# Altium project TestPCB.PrjPcb
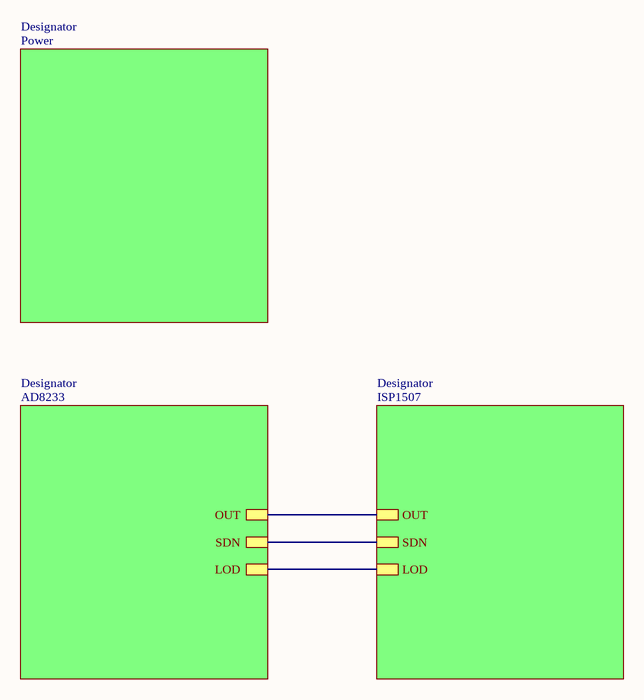
[diagram p0: main.SchDoc]
4 sheets, 45 parts. Net scope: hierarchical (ports join the sheet entries above them; power ports are global).
Board file: PCB1.PcbDoc
Sheets:
  main.SchDoc
    Designator = Power.SchDoc
    Designator = AD8233.SchDoc
    Designator = ISP1507.SchDoc

## Sheet main.SchDoc
size A3

### Sub-sheets
Designator = Power: no entries
Designator = AD8233: SDN, OUT, LOD
Designator = ISP1507: OUT, SDN, LOD

### Nets
LOD: sheet Designator/LOD, sheet Designator/LOD
OUT: sheet Designator/OUT, sheet Designator/OUT
SDN: sheet Designator/SDN, sheet Designator/SDN

## Sheet Power.SchDoc: Наименование
size 420 x 297 mm; ApprovedBy: Утвердил; CheckedBy: Проверил; Author: Разработал; CompanyName: ВлГУ; DrawnBy: Н.Контр; Engineer: Т.Контр; SheetNumber: 3; SheetTotal: 1; PageSetup: Record=PageOptions|CenterHorizontal=True|CenterVertical=True|PrintScale=0.94|XCorrection=1.00|YCorrection=1.00|PrintKind=1|BorderSize=5000000|LeftOffset=0|BottomOffset=0|Orientation=1|PaperLength=1000|PaperWidth=1000|Scale=100|PaperSource=7|PrintQuality=-4|MediaType=1|DitherType=10|PaperKind=A4|PrintScaleMode=1; HeadOfSector: Нач. сектора; MainDevice: Перв.примен.; Name: Наименование; DocumentName: Sheet1.SCHDOC
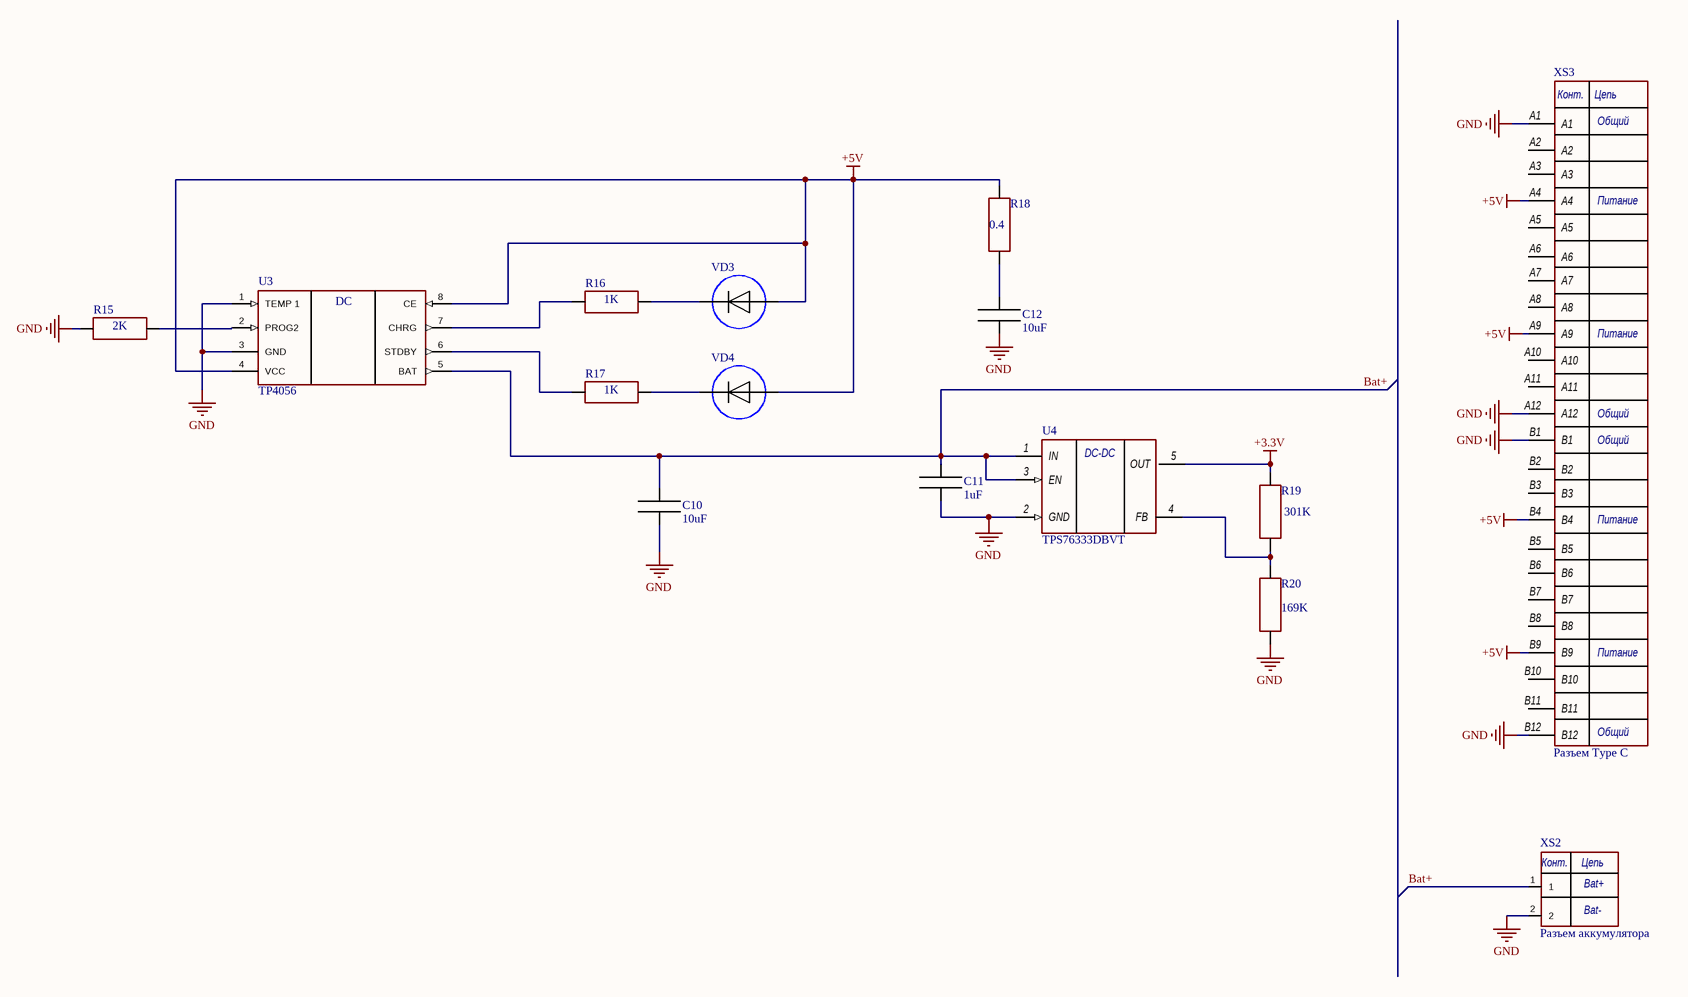
[diagram p1: Power.SchDoc]

### Parts
C10  10uF  [0402]
C11  1uF  [0402]
C12  10uF  [0402]
R15  2K  [0402]
R16  1K  [0402]
R17  1K  [0402]
R18  0.4  [0402]
R19  301K  [0402]
R20  169K  [0402]
U3  TP4056  [SOP-8]
U4  TPS76333DBVT  [SOT23-5]
VD3  Светодиод  [0402]  (value not drawn)
VD4  Светодиод  [0402]  (value not drawn)
XS2  Разъем аккумулятора  [PIN 2]
XS3  Разъем Type C  [USB Type C]

### Nets
+3.3V: R19.2 U4.5(OUT)
+5V: R18.2 U3.4(VCC) U3.8(CE) VD3.1 VD4.1 XS3.A4 XS3.A9 XS3.B4 XS3.B9
GND: C10.1 C11.1 C12.1 R15.1 R20.1 U3.1(TEMP_1) U3.3(GND) U4.2(GND) XS2.2 XS3.A1 XS3.A12 XS3.B1 XS3.B12
Bat+: C10.2 C11.2 U3.5(BAT) U4.1(IN) U4.3(EN) XS2.1
NetC12_2: C12.2 R18.1
NetR15_2: R15.2 U3.2(PROG2)
NetR16_1: R16.1 U3.7(CHRG)
NetR16_2: R16.2 VD3.2
NetR17_1: R17.1 U3.6(STDBY)
NetR17_2: R17.2 VD4.2
NetR19_1: R19.1 R20.2 U4.4(FB)

Not connected (* = marked no-connect by the designer): XS3 A2 A3 A5 A6 A7 A8 A10 A11 B2 B3 B5 B6 B7 B8 B10 B11

### Notes on the sheet
- (near XS3) Общий
- (near XS3) Питание
- (near XS2) Bat+
- (near XS2) Bat-
- Подп. и дата
- Инв.№ дубл.
- Взам.инв.№
- Подп.и дата
- Инв.№ подл.
- Изм.
- Лист
- № докум.
- Подп.
- Дата
- Формат  A3
- (in symbol TP4056) DC
- (in symbol TPS76333DBVT) DC-DC
- (in symbol Разъем 2) Конт.; Цепь
- (in symbol Разъем Type C) Конт.; Цепь

### Library data of the parts
C10-C12 = Конденсатор
R15-R20 = Резистор
XS2 = Разъем 2

## Sheet AD8233.SchDoc: Наименование
size 420 x 297 mm; Author: Мингалеев А.А.; SheetNumber: 1; SheetTotal: 1; PageSetup: Record=PageOptions|CenterHorizontal=True|CenterVertical=True|PrintScale=0.94|XCorrection=1.00|YCorrection=1.00|PrintKind=1|BorderSize=5000000|LeftOffset=0|BottomOffset=0|Orientation=1|PaperLength=1000|PaperWidth=1000|Scale=100|PaperSource=7|PrintQuality=-4|MediaType=1|DitherType=10|PaperKind=A4|PrintScaleMode=1; MainDevice: Перв.примен.; Name: Тестовое задание; DocumentName: Sheet1.SCHDOC
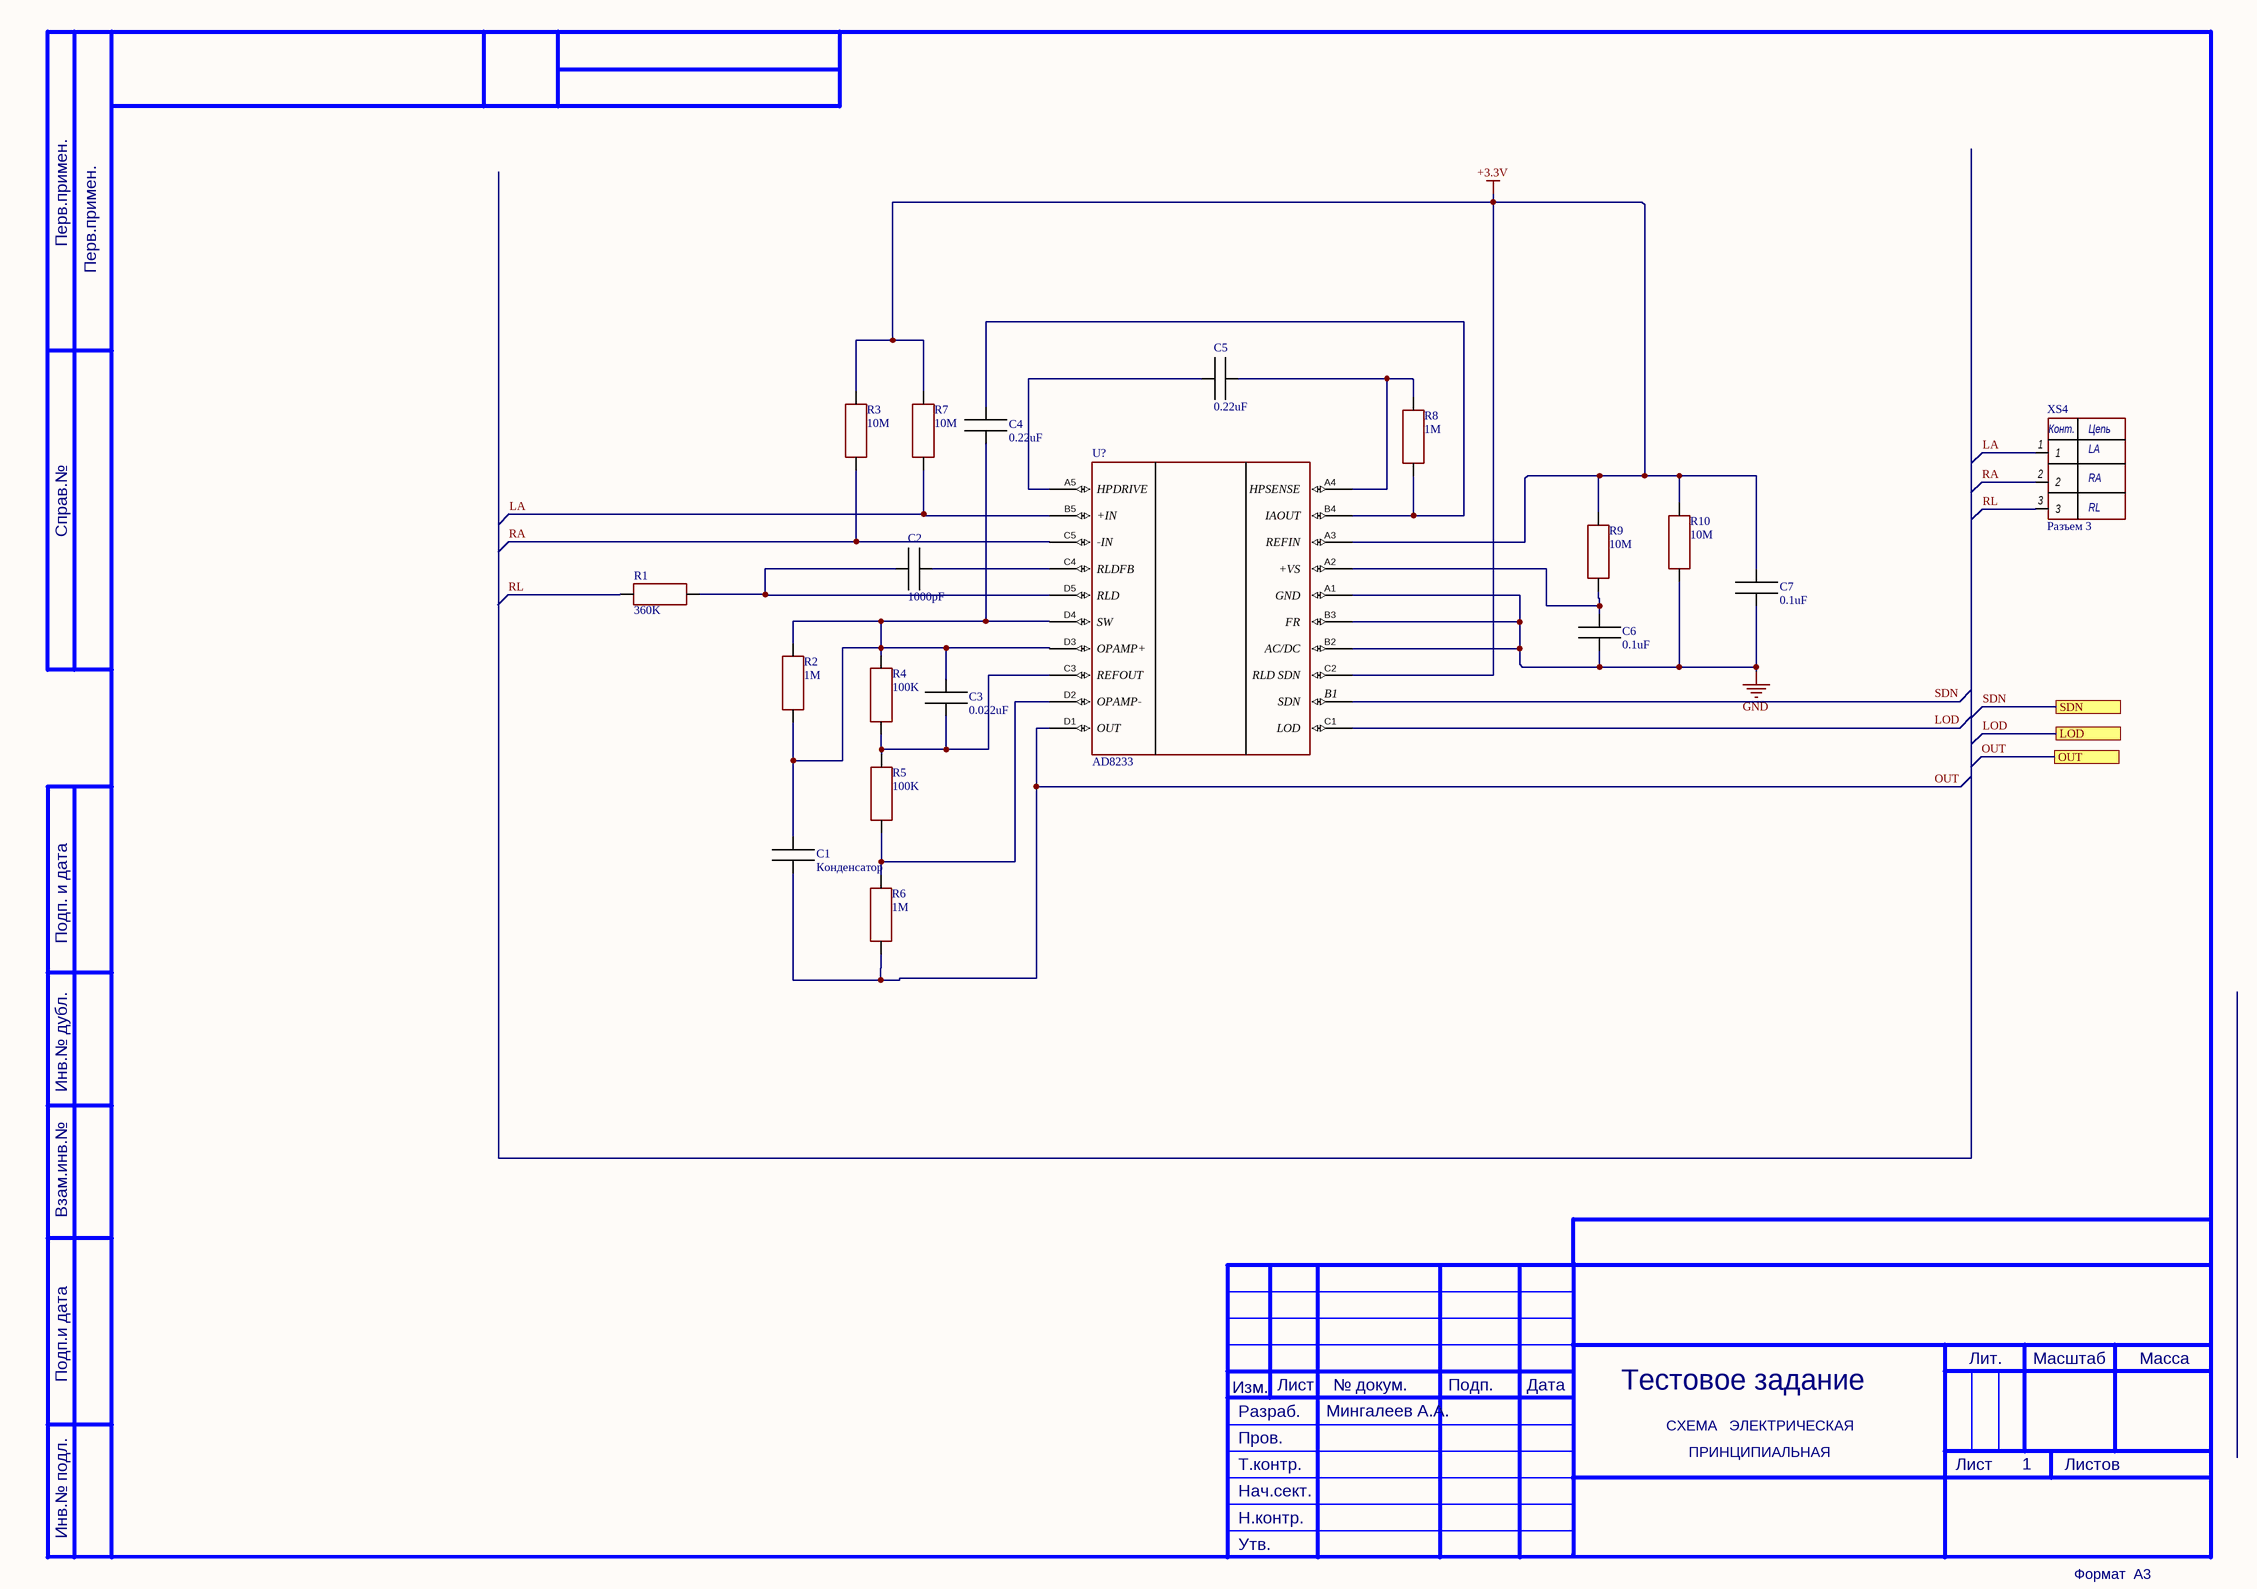
[diagram p2: AD8233.SchDoc]

### Parts
C1  Конденсатор  [0402]
C2  1000pF  [0402]
C3  0.022uF  [0402]
C4  0.22uF  [0402]
C5  0.22uF  [0402]
C6  0.1uF  [0402]
C7  0.1uF  [0402]
R1  360K  [0402]
R2  1M  [0402]
R3  10M  [0402]
R4  100K  [0402]
R5  100K  [0402]
R6  1M  [0402]
R7  10M  [0402]
R8  1M  [0402]
R9  10M  [0402]
R10  10M  [0402]
U1  AD8233  [WLCSP]
XS4  Разъем 3  [PIN 3]

### Ports
LOD, OUT, SDN

### Nets
+3.3V: C7.2 R3.2 R7.2 R9.2 R10.2 U1.A3(REFIN) U1.C2(RLD_SDN)
GND: C6.1 C7.1 R10.1 U1.A1(GND) U1.B2(AC/DC) U1.B3(FR)
LA: R7.1 U1.B5(+IN) XS4.1
OUT: C1.1 R6.1 U1.D1(OUT) ; port OUT
RA: R3.1 U1.C5(-IN) XS4.2
RL: R1.2 XS4.3
NetC1_2: C1.2 C3.2 C4.1 R2.1 R2.2 R4.2 U1.D3(OPAMP+) U1.D4(SW)
NetC2_1: C2.1 U1.C4(RLDFB)
NetC2_2: C2.2 R1.1 U1.D5(RLD)
NetC3_1: C3.1 R4.1 R5.2 U1.C3(REFOUT)
NetC4_2: C4.2 R8.1 U1.B4(IAOUT)
NetC5_1: C5.1 R8.2 U1.A4(HPSENSE)
NetC5_2: C5.2 U1.A5(HPDRIVE)
NetC6_2: C6.2 R9.1 U1.A2(+VS)
NetR5_1: R5.1 R6.2 U1.D2(OPAMP-)

Not connected (* = marked no-connect by the designer): U1 B1(SDN_) C1(LOD_)

### Notes on the sheet
- (near XS4) LA
- (near XS4) RA
- (near XS4) RL
- Labels drawn without touching a wire or pin: LOD, SDN
- Перв.примен.
- Справ.№
- Подп. и дата
- Инв.№ дубл.
- Взам.инв.№
- Подп.и дата
- Разраб.
- Изм.
- Лист
- № докум.
- Подп.
- Дата
- Лит.
- Масштаб
- Масса
- Т.контр.
- Пров.
- СХЕМА   ЭЛЕКТРИЧЕСКАЯ
- ПРИНЦИПИАЛЬНАЯ
- Листов
- Инв.№ подл.
- Утв.
- Н.контр.
- Нач.сект.
- Формат  A3
- (in symbol Разъем 3) Конт.; Цепь

### Library data of the parts
C2-C7 = Конденсатор
R1-R10 = Резистор

## Sheet ISP1507.SchDoc
size 420 x 297 mm; ApprovedBy: Утвердил; CheckedBy: Проверил; Author: Разработал; CompanyName: ВлГУ; DrawnBy: Н.Контр; Engineer: Т.Контр; SheetNumber: 2; SheetTotal: 1; PageSetup: Record=PageOptions|CenterHorizontal=True|CenterVertical=True|PrintScale=0.94|XCorrection=1.00|YCorrection=1.00|PrintKind=1|BorderSize=5000000|LeftOffset=0|BottomOffset=0|Orientation=1|PaperLength=1000|PaperWidth=1000|Scale=100|PaperSource=7|PrintQuality=-4|MediaType=1|DitherType=10|PaperKind=A4|PrintScaleMode=1; HeadOfSector: Нач. сектора; MainDevice: Перв.примен.; Name: Наименование; DocumentName: Sheet1.SCHDOC
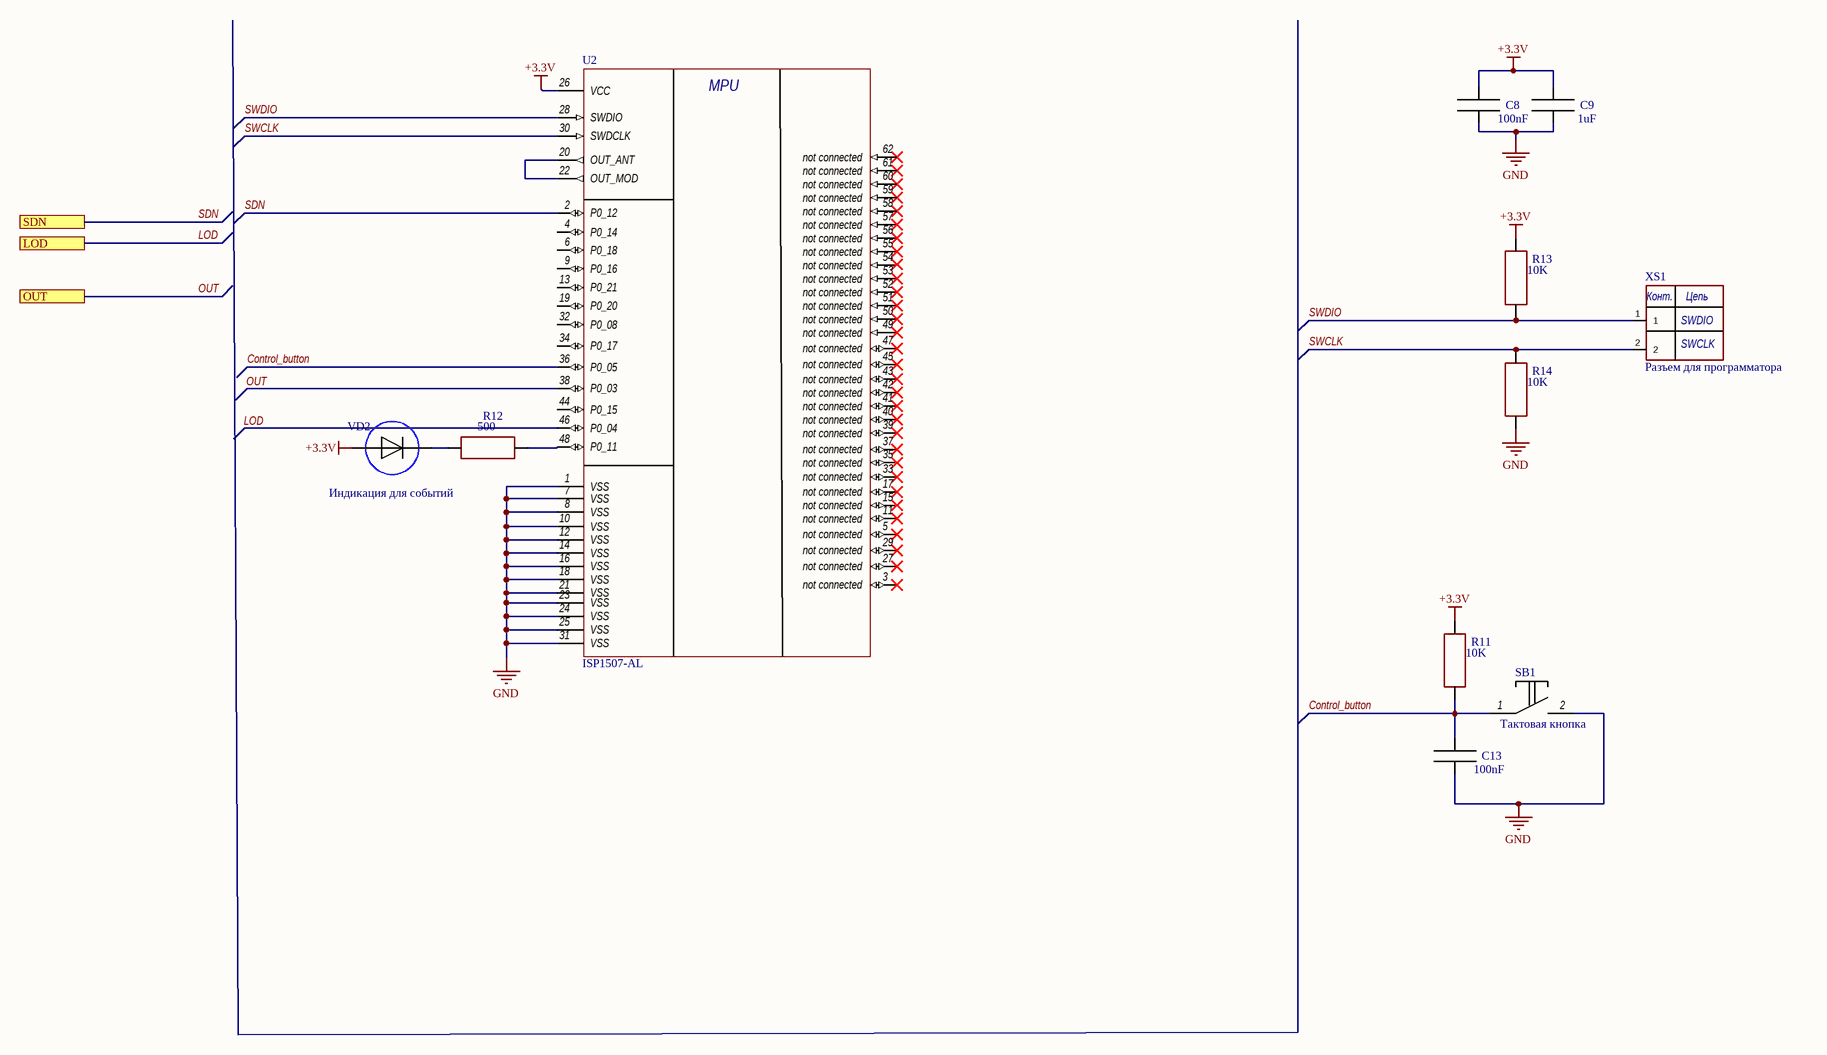
[diagram p3: ISP1507.SchDoc]

### Parts
C8  100nF  [0402]
C9  1uF  [0402]
C13  100nF  [0402]
R11  10K  [0402]
R12  500  [0402]
R13  10K  [0402]
R14  10K  [0402]
SB1  Тактовая кнопка  [2565]
U2  ISP1507-AL  [LGA QFN]
VD2  Event  [0402]  (value not drawn)
XS1  Разъем для программатора  [PIN 2]

### Ports
LOD, OUT, SDN

### Nets
+3.3V: C8.2 C9.2 R11.2 R13.2 U2.26(VCC) VD2.1
GND: C8.1 C9.1 C13.1 R14.1 SB1.2 U2.1(VSS) U2.7(VSS) U2.8(VSS) U2.10(VSS) U2.12(VSS) U2.14(VSS) U2.16(VSS) U2.18(VSS) U2.21(VSS) U2.23(VSS) U2.24(VSS) U2.25(VSS) U2.31(VSS)
Control_button: C13.2 R11.1 SB1.1 U2.36(P0_05)
OUT: U2.38(P0_03) ; port OUT
SDN: U2.2(P0_12) ; port SDN
SWCLK: R14.2 U2.30(SWDCLK) XS1.2
SWDIO: R13.1 U2.28(SWDIO) XS1.1
NetR12_1: R12.1 U2.48(P0_11)
NetR12_2: R12.2 VD2.2
NetU2_20: U2.20(OUT_ANT) U2.22(OUT_MOD)

Not connected (* = marked no-connect by the designer): U2 3(not_connected)* 4(P0_14) 5(not_connected)* 6(P0_18) 9(P0_16) 11(not_connected)* 13(P0_21) 15(not_connected)* 17(not_connected)* 19(P0_20) 27(not_connected)* 29(not_connected)* 32(P0_08) 33(not_connected)* 34(P0_17) 35(not_connected)* 37(not_connected)* 39(not_connected)* 40(not_connected)* 41(not_connected)* 42(not_connected)* 43(not_connected)* 44(P0_15) 45(not_connected)* 46(P0_04) 47(not_connected)* 49(not_connected)* 50(not_connected)* 51(not_connected)* 52(not_connected)* 53(not_connected)* 54(not_connected) 55(not_connected)* 56(not_connected)* 57(not_connected)* 58(not_connected)* 59(not_connected)* 60(not_connected)* 61(not_connected)* 62(not_connected)*

### Notes on the sheet
- (near XS1) SWDIO
- (near XS1) SWCLK
- Индикация для событий
- Labels drawn without touching a wire or pin: LOD
- Подп. и дата
- Инв.№ дубл.
- Взам.инв.№
- Подп.и дата
- Инв.№ подл.
- Изм.
- Лист
- № докум.
- Подп.
- Дата
- Формат  A3
- (in symbol ISP1507) MPU
- (in symbol Разъем 2) Конт.; Цепь

### Library data of the parts
C8 C9 C13 = Конденсатор
R11-R14 = Резистор
U2 = ISP1507
VD2 = Светодиод
XS1 = Разъем 2

## Nets that join several sheets
+3.3V: Power (R19.2 U4.5), AD8233 (7 pins), ISP1507 (6 pins)
GND: Power (13 pins), AD8233 (6 pins), ISP1507 (18 pins)
OUT: AD8233 (C1.1 R6.1 U1.D1), ISP1507 (U2.38)